# EAGLE design led-board (EAGLE 8.3.2)
DESIGNER: Jon Newman; DESIGN_NAME: LED-BOARD; LICENSE: CERN OHL v1.2; REVISION: 1.0
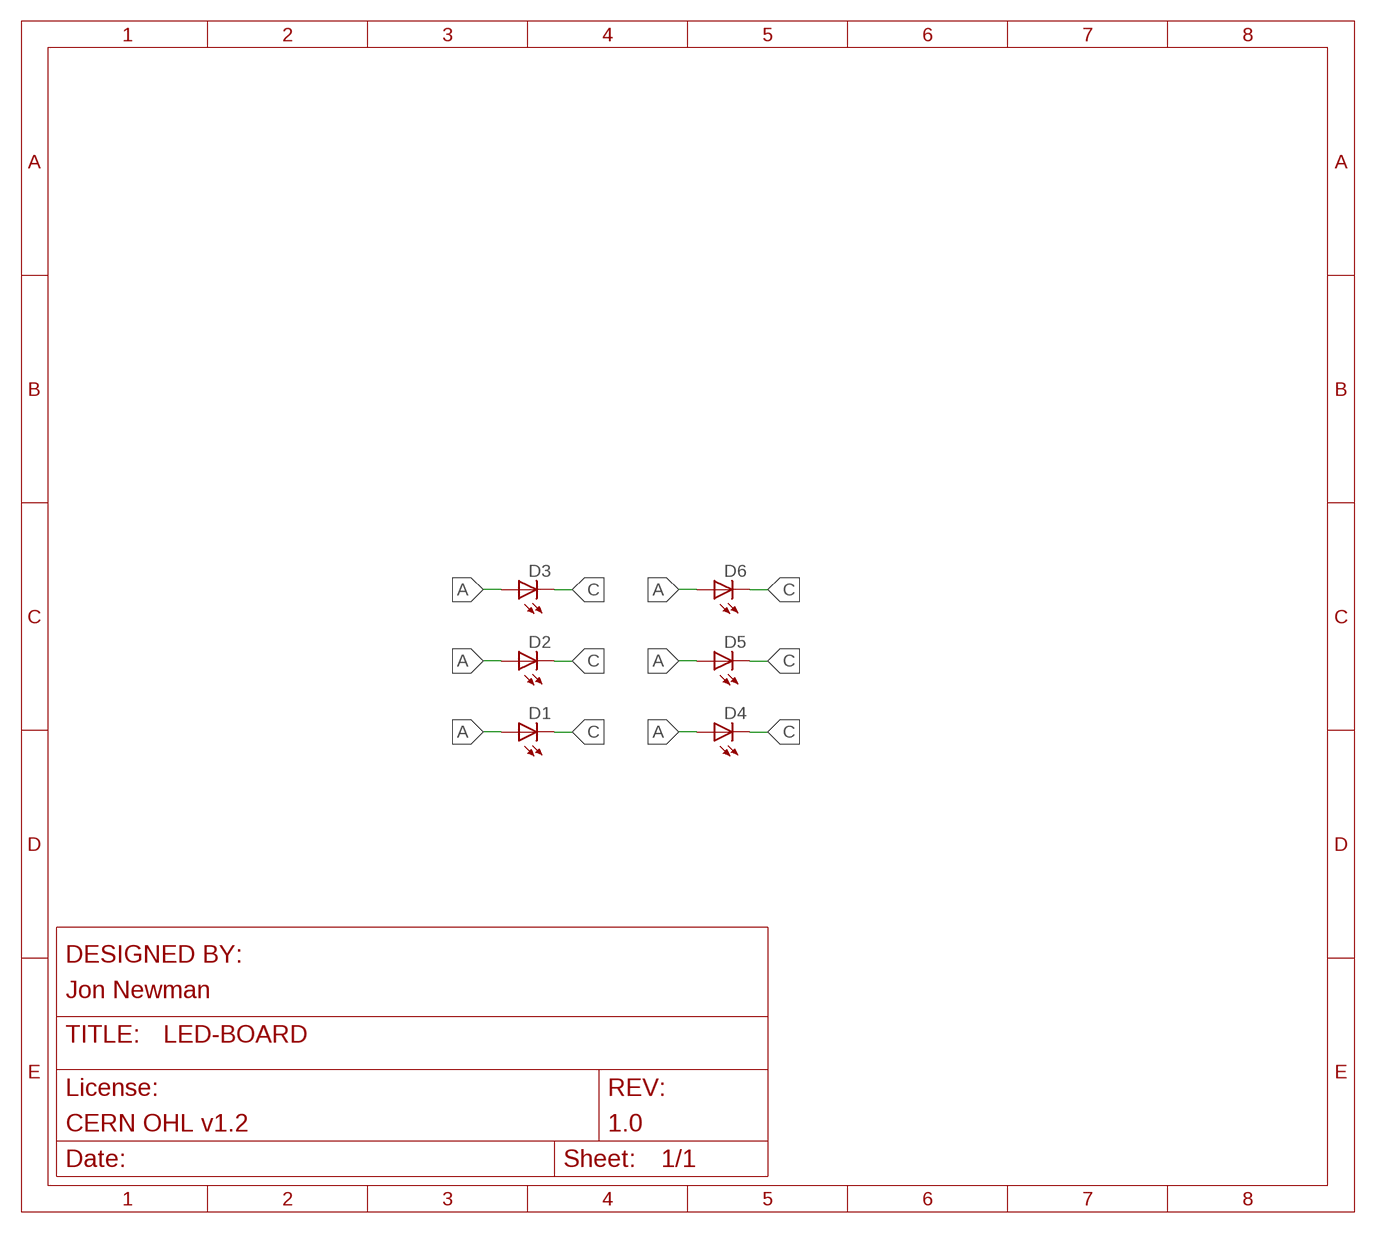
[diagram p0: schematic, sheet 1]

## Parts
D1  LED_LXZ1  [LXZ1]
D2  LED_LXZ1  [LXZ1]
D3  LED_LXZ1  [LXZ1]
D4  LED_LXZ1  [LXZ1]
D5  LED_LXZ1  [LXZ1]
D6  LED_LXZ1  [LXZ1]

## Nets
A: D1.A D2.A D3.A D4.A D5.A D6.A
C: D1.C D2.C D3.C D4.C D5.C D6.C

## Library data of the parts
D1-D6 = jonnew:LED: Surface mount LED

## Board
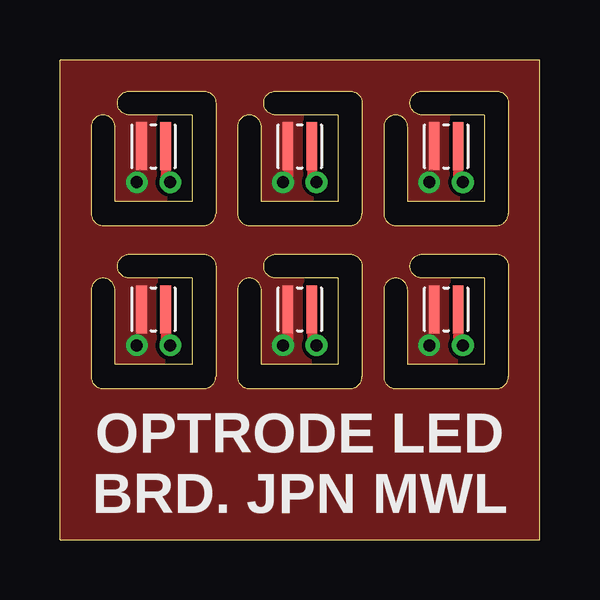
[diagram p1: board, top side]
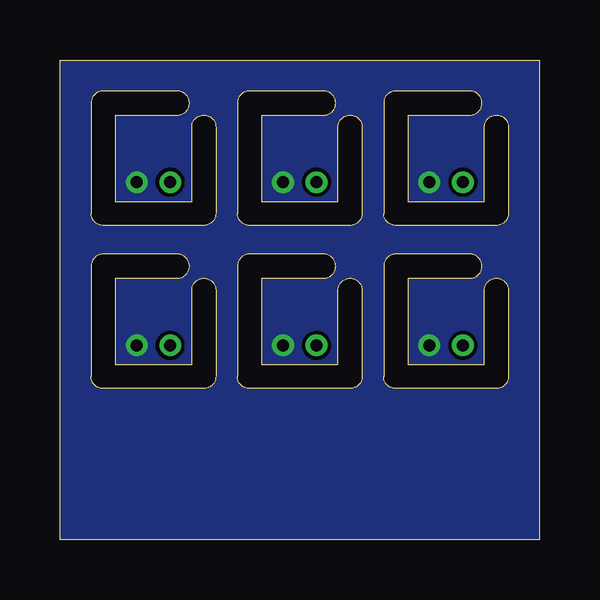
[diagram p2: board, bottom side, seen from below]

Size 20 x 20 mm. Coordinates in mm from the lower left corner, seen from the top.
Outline: 0,0 20,0 20,20 0,20 0,0
Outline: 2.3,14.1 2.3,17.2 arc90 1.8,17.7 arc90 1.3,17.2 1.3,13.6 arc90 1.8,13.1 6,13.1 arc90 6.5,13.6 6.5,18.2 arc90 6,18.7 2.9,18.7 arc90 2.4,18.2 arc90 2.9,17.7 5.5,17.7 5.5,14.1 2.3,14.1
Outline: 8.4,14.1 8.4,17.2 arc90 7.9,17.7 arc90 7.4,17.2 7.4,13.6 arc90 7.9,13.1 12.1,13.1 arc90 12.6,13.6 12.6,18.2 arc90 12.1,18.7 9,18.7 arc90 8.5,18.2 arc90 9,17.7 11.6,17.7 11.6,14.1 8.4,14.1
Outline: 14.5,14.1 14.5,17.2 arc90 14,17.7 arc90 13.5,17.2 13.5,13.6 arc90 14,13.1 18.2,13.1 arc90 18.7,13.6 18.7,18.2 arc90 18.2,18.7 15.1,18.7 arc90 14.6,18.2 arc90 15.1,17.7 17.7,17.7 17.7,14.1 14.5,14.1
Outline: 2.3,7.3 2.3,10.4 arc90 1.8,10.9 arc90 1.3,10.4 1.3,6.8 arc90 1.8,6.3 6,6.3 arc90 6.5,6.8 6.5,11.4 arc90 6,11.9 2.9,11.9 arc90 2.4,11.4 arc90 2.9,10.9 5.5,10.9 5.5,7.3 2.3,7.3
Outline: 8.4,7.3 8.4,10.4 arc90 7.9,10.9 arc90 7.4,10.4 7.4,6.8 arc90 7.9,6.3 12.1,6.3 arc90 12.6,6.8 12.6,11.4 arc90 12.1,11.9 9,11.9 arc90 8.5,11.4 arc90 9,10.9 11.6,10.9 11.6,7.3 8.4,7.3
Outline: 14.5,7.3 14.5,10.4 arc90 14,10.9 arc90 13.5,10.4 13.5,6.8 arc90 14,6.3 18.2,6.3 arc90 18.7,6.8 18.7,11.4 arc90 18.2,11.9 15.1,11.9 arc90 14.6,11.4 arc90 15.1,10.9 17.7,10.9 17.7,7.3 14.5,7.3
Copper layers (1*16): Top 0.0356mm / dielectric 1.5011mm / Bottom 0.0356mm
Design rules "ohs-park-2-layer *": minimum track width 6mil, minimum drill 13mil, track to track 6mil, track to pad 6mil, pad to pad 6mil, via to via 6mil, smd to smd 6mil, copper to edge 1mil, drill to drill 6mil, minimum pad ring 7mil, minimum via ring 7mil, stop-mask expansion 4mil, vias tented up to drill 100mil, thermal gap 10mil

### Footprints (pad centres in the part's own frame; a part is rotated, then mirrored left to right if it is on the bottom)
LXZ1 = smd 0.45 x 2: A 0.5,0; C -0.5,0

### Placement (x,y rotation side)
D1  3.9,16.4 0 top
D2  10,16.4 0 top
D3  16.1,16.4 0 top
D4  3.9,9.6 0 top
D5  10,9.6 0 top
D6  16.1,9.6 0 top

### Tracks (layer width: path | path; a pad name or v marks a point on that pad's centre or on a via)
A  (via drill 0.5 pad 0.9)
  Top 0.406: D2.A 10.5,15.1 v10.7,14.9 | D5.A 10.5,8.3 v10.7,8.1 | D1.A 4.4,15.1 v4.6,14.9 | D4.A 4.4,8.3 v4.6,8.1 | D6.A 16.6,8.3 v16.8,8.1 | D3.A 16.6,15.1 v16.8,14.9
  pour Bottom (no thermals): 0,20 20,20 20,0 0,0
C  (via drill 0.5 pad 0.9)
  Top 0.406: D2.C 9.5,15.1 v9.3,14.9 | D5.C 9.5,8.3 v9.3,8.1
  other vias: 15.4,14.9 3.2,14.9 3.2,8.1 15.4,8.1
  pour Top (no thermals): 0,20 20,20 20,0 0,0

### Text on the board
tPlace: OPTRODE LED / BRD. JPN MWL